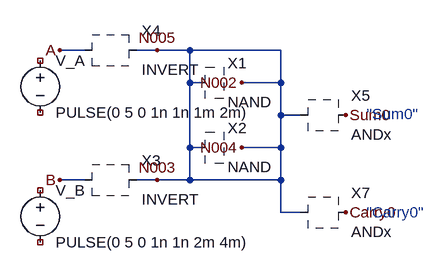
[diagram p0: schematic lab2-update-feb8-graphical.asc]
lab2-update-feb8-graphical.asc, the LTspice schematic file:
Version 4.1
SHEET 1 880 680
WIRE 118 150 80 150
WIRE 230 150 198 150
WIRE 280 150 230 150
WIRE 420 150 280 150
WIRE 280 200 280 150
WIRE 300 200 280 200
WIRE 420 200 420 150
WIRE 420 200 360 200
WIRE 420 250 420 200
WIRE 450 250 420 250
WIRE 280 300 280 200
WIRE 300 300 280 300
WIRE 420 300 420 250
WIRE 420 300 360 300
WIRE 118 350 80 350
WIRE 230 350 198 350
WIRE 280 350 280 300
WIRE 280 350 230 350
WIRE 420 350 420 300
WIRE 420 350 280 350
WIRE 420 400 420 350
WIRE 450 400 420 400
FLAG 80 150 A
FLAG 80 350 B
FLAG 230 150 N005
FLAG 230 350 N003
FLAG 360 200 N002
FLAG 360 300 N004
FLAG 520 250 Sum0
FLAG 520 400 Carry0
SYMBOL voltage 50 150 R0
SYMATTR InstName V_A
SYMATTR Value PULSE(0 5 0 1n 1n 1m 2m)
SYMBOL voltage 50 350 R0
SYMATTR InstName V_B
SYMATTR Value PULSE(0 5 0 1n 1n 2m 4m)
SYMBOL INVERT 150 150 R0
SYMATTR InstName X4
SYMBOL INVERT 150 350 R0
SYMATTR InstName X3
SYMBOL NAND 300 200 R0
SYMATTR InstName X1
SYMBOL NAND 300 300 R0
SYMATTR InstName X2
SYMBOL ANDx 450 250 R0
SYMATTR InstName X5
SYMBOL ANDx 450 400 R0
SYMATTR InstName X7
TEXT 552 248 Left 2 ;"Sum0"
TEXT 552 400 Left 2 ;"Carry0"

The netlist it stands for:
* lab2-update-feb8-graphical.asc
V_A NC_01 NC_02 PULSE(0 5 0 1n 1n 1m 2m)
V_B NC_03 NC_04 PULSE(0 5 0 1n 1n 2m 4m)
* X4: INVERT (symbol INVERT not available, pin order unknown); nets seen at it: A, N004
* X3: INVERT (symbol INVERT not available, pin order unknown); nets seen at it: B, N004
* X1: NAND (symbol NAND not available, pin order unknown); nets seen at it: N004
* X2: NAND (symbol NAND not available, pin order unknown); nets seen at it: N004
* X5: ANDx (symbol ANDx not available, pin order unknown); nets seen at it: N004, Sum0
* X7: ANDx (symbol ANDx not available, pin order unknown); nets seen at it: Carry0, N004
* "Sum0"
* "Carry0"
.backanno
.end